# Altium schematic sheet MCU_Control.SchDoc
size A4; SheetNumber: 3; SheetTotal: 5
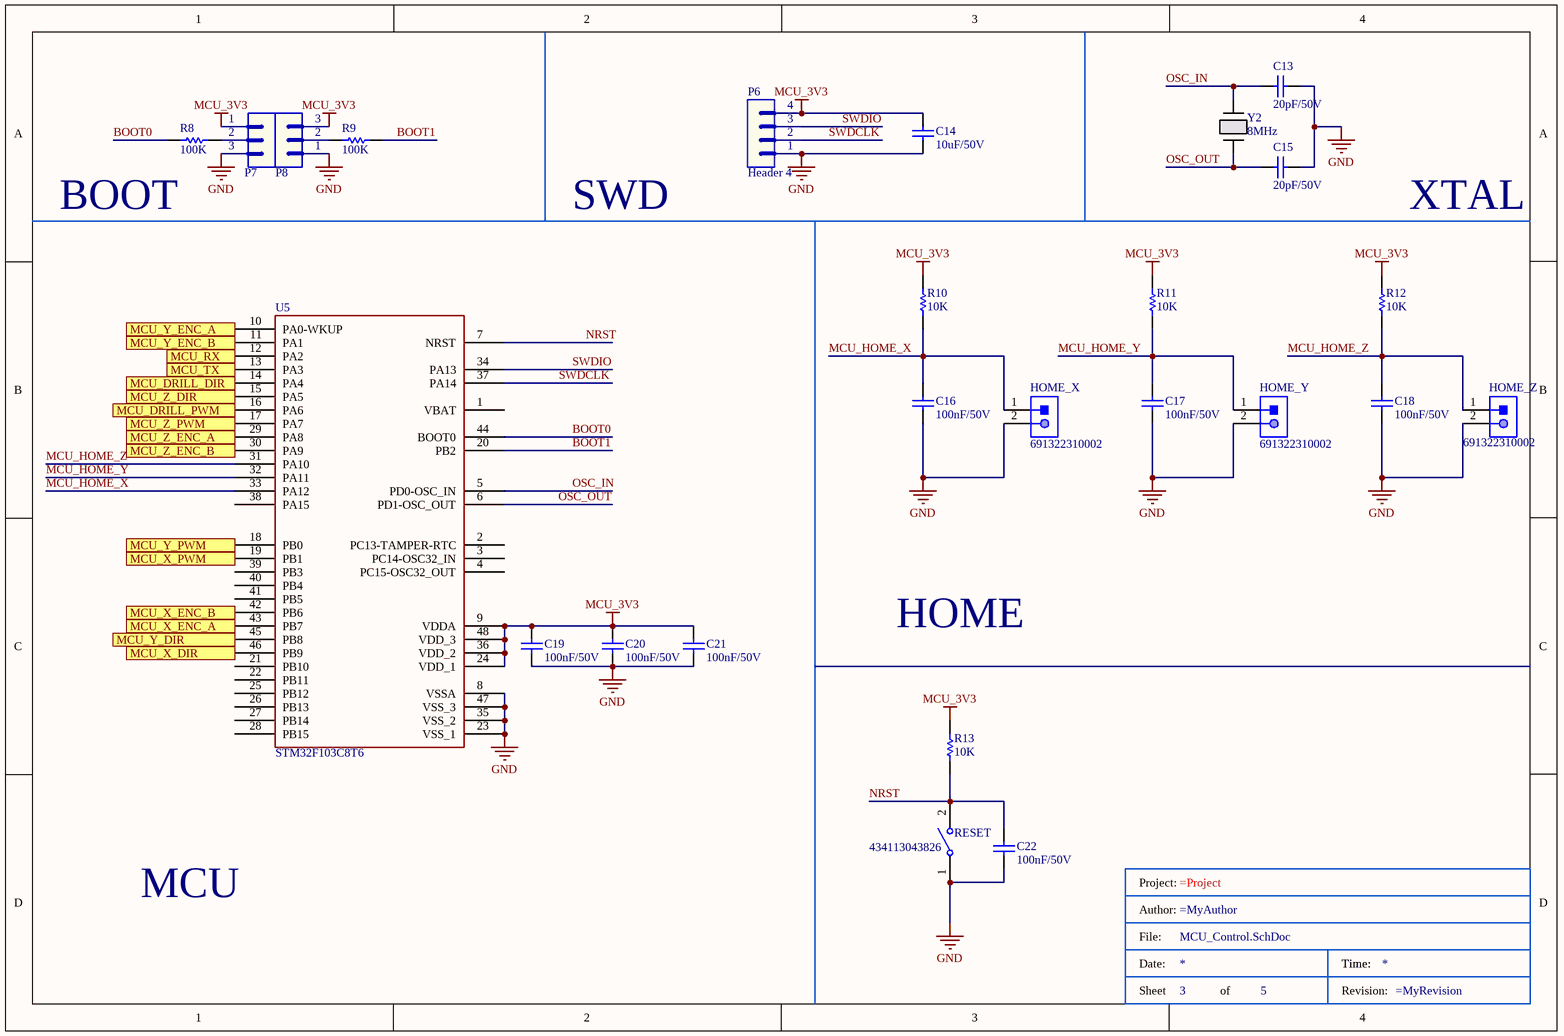
[diagram p0: MCU_Control.SchDoc]

## Parts
*  Title Block  (value not drawn)  (graphical)
C13  value 20pF/50V  [CAP-SM-0805]  (hidden comment: Cap-22pF-50V-0805)
C14  value 10uF/50V  [CAP-SM-0805]  (hidden comment: Cap-10uF-50V-0805)
C15  value 20pF/50V  [CAP-SM-0805]  (hidden comment: Cap-22pF-50V-0805)
C16  value 100nF/50V  [CAP-SM-0805]  (hidden comment: Cap-100nF-50V-0805)
C17  value 100nF/50V  [CAP-SM-0805]  (hidden comment: Cap-100nF-50V-0805)
C18  value 100nF/50V  [CAP-SM-0805]  (hidden comment: Cap-100nF-50V-0805)
C19  value 100nF/50V  [CAP-SM-0805]  (hidden comment: Cap-100nF-50V-0805)
C20  value 100nF/50V  [CAP-SM-0805]  (hidden comment: Cap-100nF-50V-0805)
C21  value 100nF/50V  [CAP-SM-0805]  (hidden comment: Cap-100nF-50V-0805)
C22  value 100nF/50V  [CAP-SM-0805]  (hidden comment: Cap-100nF-50V-0805)
HOME_X  691322310002  [691322310002]
HOME_Y  691322310002  [691322310002]
HOME_Z  691322310002  [691322310002]
P6  Header 4  [JP4]
P7  Header 3  [JP3]  (value not drawn)
P8  Header 3  [JP3]  (value not drawn)
R8  value 100K  [RES-SM-0805]  (hidden comment: Res-100K-0805)
R9  value 100K  [RES-SM-0805]  (hidden comment: Res-100K-0805)
R10  value 10K  [RES-SM-0805]  (hidden comment: Res-10k-0805)
R11  value 10K  [RES-SM-0805]  (hidden comment: Res-10k-0805)
R12  value 10K  [RES-SM-0805]  (hidden comment: Res-10k-0805)
R13  value 10K  [RES-SM-0805]  (hidden comment: Res-10k-0805)
RESET  434113043826  [434113043826]
U5  STM32F103C8T6  [LQFP-48]
Y2  8MHz  [xtal2_CX5032GB_AVX-L]

## Ports
MCU_DRILL_DIR (out), MCU_DRILL_PWM (out), MCU_RX (out), MCU_TX (in), MCU_X_DIR (out), MCU_X_ENC_A (in), MCU_X_ENC_B (in), MCU_X_PWM (out), MCU_Y_DIR (out), MCU_Y_ENC_A (in), MCU_Y_ENC_B (in), MCU_Y_PWM (out), MCU_Z_DIR (out), MCU_Z_ENC_A (in), MCU_Z_ENC_B (in), MCU_Z_PWM (out)

## Nets
GND: C13.1 C14.1 C15.1 C16.1 C17.1 C18.1 C19.2 C20.2 C21.2 C22.1 HOME_X.2 HOME_Y.2 HOME_Z.2 P6.1 P7.3 P8.1 RESET.1 U5.8(VSSA) U5.23(VSS_1) U5.35(VSS_2) U5.47(VSS_3)
MCU_3V3: C14.2 C19.1 C20.1 C21.1 P6.4 P7.1 P8.3 R10.2 R11.2 R12.2 R13.2 U5.9(VDDA) U5.24(VDD_1) U5.36(VDD_2) U5.48(VDD_3)
BOOT0: R8.1 U5.44(BOOT0)
BOOT1: R9.2 U5.20(PB2)
MCU_DRILL_DIR: U5.14(PA4) ; port MCU_DRILL_DIR
MCU_DRILL_PWM: U5.16(PA6) ; port MCU_DRILL_PWM
MCU_HOME_X: C16.2 HOME_X.1 R10.1 U5.33(PA12)
MCU_HOME_Y: C17.2 HOME_Y.1 R11.1 U5.32(PA11)
MCU_HOME_Z: C18.2 HOME_Z.1 R12.1 U5.31(PA10)
MCU_RX: U5.12(PA2) ; port MCU_RX
MCU_TX: U5.13(PA3) ; port MCU_TX
MCU_X_DIR: U5.46(PB9) ; port MCU_X_DIR
MCU_X_ENC_A: U5.43(PB7) ; port MCU_X_ENC_A
MCU_X_ENC_B: U5.42(PB6) ; port MCU_X_ENC_B
MCU_X_PWM: U5.19(PB1) ; port MCU_X_PWM
MCU_Y_DIR: U5.45(PB8) ; port MCU_Y_DIR
MCU_Y_ENC_A: U5.10(PA0-WKUP) ; port MCU_Y_ENC_A
MCU_Y_ENC_B: U5.11(PA1) ; port MCU_Y_ENC_B
MCU_Y_PWM: U5.18(PB0) ; port MCU_Y_PWM
MCU_Z_DIR: U5.15(PA5) ; port MCU_Z_DIR
MCU_Z_ENC_A: U5.29(PA8) ; port MCU_Z_ENC_A
MCU_Z_ENC_B: U5.30(PA9) ; port MCU_Z_ENC_B
MCU_Z_PWM: U5.17(PA7) ; port MCU_Z_PWM
NRST: C22.2 R13.1 RESET.2 U5.7(NRST)
OSC_IN: C13.2 U5.5(PD0-OSC_IN) Y2.1
OSC_OUT: C15.2 U5.6(PD1-OSC_OUT) Y2.2
SWDCLK: P6.2 U5.37(PA14)
SWDIO: P6.3 U5.34(PA13)
NetP7_2: P7.2 R8.2
NetP8_2: P8.2 R9.1

Not connected (* = marked no-connect by the designer): U5 1(VBAT) 2(PC13-TAMPER-RTC) 3(PC14-OSC32_IN) 4(PC15-OSC32_OUT) 21(PB10) 22(PB11) 25(PB12) 26(PB13) 27(PB14) 28(PB15) 38(PA15) 39(PB3) 40(PB4) 41(PB5)

## Notes on the sheet
- (near R8) BOOT
- SWD
- XTAL
- HOME
- MCU
- (in symbol Title Block) Project:; Author:; File:; Date:; Time:; Sheet; of; Revision:

## Library data of the parts
C13 C15 = Cap-22pF-50V-0805: CAP CER 22PF 100V X7R 0805; Manufacturer: Johanson Dielectrics Inc.; Manufacturer Part Number: 101X15W102MV4E; Local Supplier: thegioiic; Local Supplier Link: https://thegioiic.com/products/tu-1nf-50v-0805; Supplier 1: Digikey; Supplier 1 Link: https://www.digikey.com/product-detail/en/johanson-dielectrics-inc/101X15W102MV4E/709-1335-1-ND/2327235; Supplier 1 Part Number: 709-1335-1-ND
C14 = Cap-10uF-50V-0805: CAP CER 10UF 50V X5R 0805; Manufacturer: Yageo; Manufacturer Part Number: CC0805KKX5R9BB106; Local Supplier: thegioiic; Local Supplier Link: https://www.thegioiic.com/products/tu-gom-0805-10uf-50v; Supplier 1: Digikey; Supplier 1 Link: https://www.digikey.com/product-detail/en/yageo/CC0805KKX5R9BB106/311-3499-2-ND/7164383; Supplier 1 Part Number: 311-3499-2-ND
C16-C22 = Cap-100nF-50V-0805: CAP CER 0.1UF 50V Y5V 0805; Manufacturer: Samsung Electro-Mechanics; Manufacturer Part Number: CL21F104ZBCNNNC; Local Supplier: thegioiic; Local Supplier Link: https://www.thegioiic.com/products/tu-gom-0805-100nf-0-1uf-50v; Supplier 1: Digikey; Supplier 1 Part Number: 1276-1007-1-ND; Supplier 1 Link: https://www.digikey.com/product-detail/en/samsung-electro-mechanics/CL21F104ZBCNNNC/1276-1007-1-ND/3889093
HOME_X HOME_Y HOME_Z = 691322310002: WR-TBL Serie 322 Horizontal PCB Header, Pluggable, pitch 3.81mm, 2p; Compliance: RoHS; Modularity: No; Pin Number: 2; Rated Current [UL]: 10A; Working Voltage [UL]: 300VAC; ComponentLink1Description: Manufacturer; ComponentLink1URL: http://www.we-online.de; ComponentLink2URL: https://katalog.we-online.de/em/datasheet/691322310002.pdf; ComponentLink2Description: Datasheet; Mounting Technology: THT; Part Number: 691322310002; Packaging: Box; Operating Temperature: -40 to +105degC; PCB/Cable/Panel: PCB; Pitch: 3.81mm; Published Date: October 2019; Type: Horizontal; Publisher: Wurth Elektronik; Application: Pluggable
P6 = Header 4: Header, 4-Pin; LatestRevisionDate: 17-Jul-2002; LatestRevisionNote: Re-released for DXP Platform.; Publisher: Altium Limited; Local Supplier: thegioiic; Local Supplier Part Number: x; Local Supplier Link: https://www.thegioiic.com/products/hang-rao-duc-don-2-54mm-40-chan-1-hang-cao-11-4mm-xuyen-lo
P7 P8 = Header 3: Header, 3-Pin; LatestRevisionDate: 17-Jul-2002; LatestRevisionNote: Re-released for DXP Platform.; Publisher: Altium Limited; Local Supplier: thegioiic; Local Supplier Part Number: x; Local Supplier Link: https://www.thegioiic.com/products/hang-rao-duc-don-2-54mm-40-chan-1-hang-cao-11-4mm-xuyen-lo
R8 R9 = Res-100K-0805: RES 0 OHM JUMPER 0805; Manufacturer: Vishay Dale; Manufacturer Part Number: WSL080500000ZEA9; Local Supplier: thegioiic; Local Supplier Link: https://www.thegioiic.com/products/dien-tro-100-kohm-0805-5; Supplier 1: Digikey; Supplier 1 Link: https://www.digikey.com/product-detail/en/vishay-dale/WSL080500000ZEA9/541-3928-1-ND/7423223; Supplier 1 Part Number: 541-3928-1-ND
R10-R13 = Res-10k-0805: RES 10K OHM 1% 1/4W 0805; Manufacturer: Stackpole Electronics Inc; Manufacturer Part Number: RNCP0805FTD10K0; Local Supplier: thegioiic; Local Supplier Link: https://www.thegioiic.com/products/dien-tro-10-kohm-0805-5; Supplier 1: Digikey; Supplier 1 Link: https://www.digikey.com/product-detail/en/stackpole-electronics-inc/RNCP0805FTD10K0/RNCP0805FTD10K0CT-ND/2240601; Supplier 1 Part Number: RNCP0805FTD10K0CT-ND
RESET = 434113043826: WS-TASV J-Bend SMT Tact Switch 6x3.5mm, height 4.3mm, 260gf; Rated Voltage: 12VDC; Rated Current: 50mA; Washable: No; ComponentLink1Description: Manufacturer; ComponentLink1URL: http://www.we-online.de; ComponentLink2Description: Datasheet; ComponentLink2URL: https://katalog.we-online.com/em/datasheet/434113043826.pdf; Operating Temperature: -40 to +85degC; Part Number: 434113043826; Published Date: September 2019; Contact Material: Stainless Steel; Height: 4.3mm; Mounting Technology: SMT; Contact Plating: Silver; Operation Force: 260gf; Packaging: Tape and Reel; Terminal Material: Copper Alloy; Publisher: Wurth Elektronik; Terminal Plating: Silver; Local Supplier: thegioiic; Local Supplier Link: https://www.thegioiic.com/products/nut-nhan-3-5x6mm-cao-5mm-2-chan-smd-dau-trang; Local Supplier Part Number: x
U5 = STM32F103C8T6: Manufacturer: ST Electronic; Manufacture Part Number: STM32F103C8T6; Local Supplier: thegioiic; Local Supplier Part Number: STM32F103C8T6; Local Supplier Link: https://www.thegioiic.com/products/stm32f103c8t6
Y2 = XTAL: No Description Available; Mfr_Name: KYOCERA AVX; Manufacturer_Part_Number: CX5032GB08000H0HEQZ1; Copyright: Copyright (C) 2023 Ultra Librarian. All rights reserved.; RefDes: RefDes; Type: DEV